# EAGLE design Main (EAGLE 6.5.0)
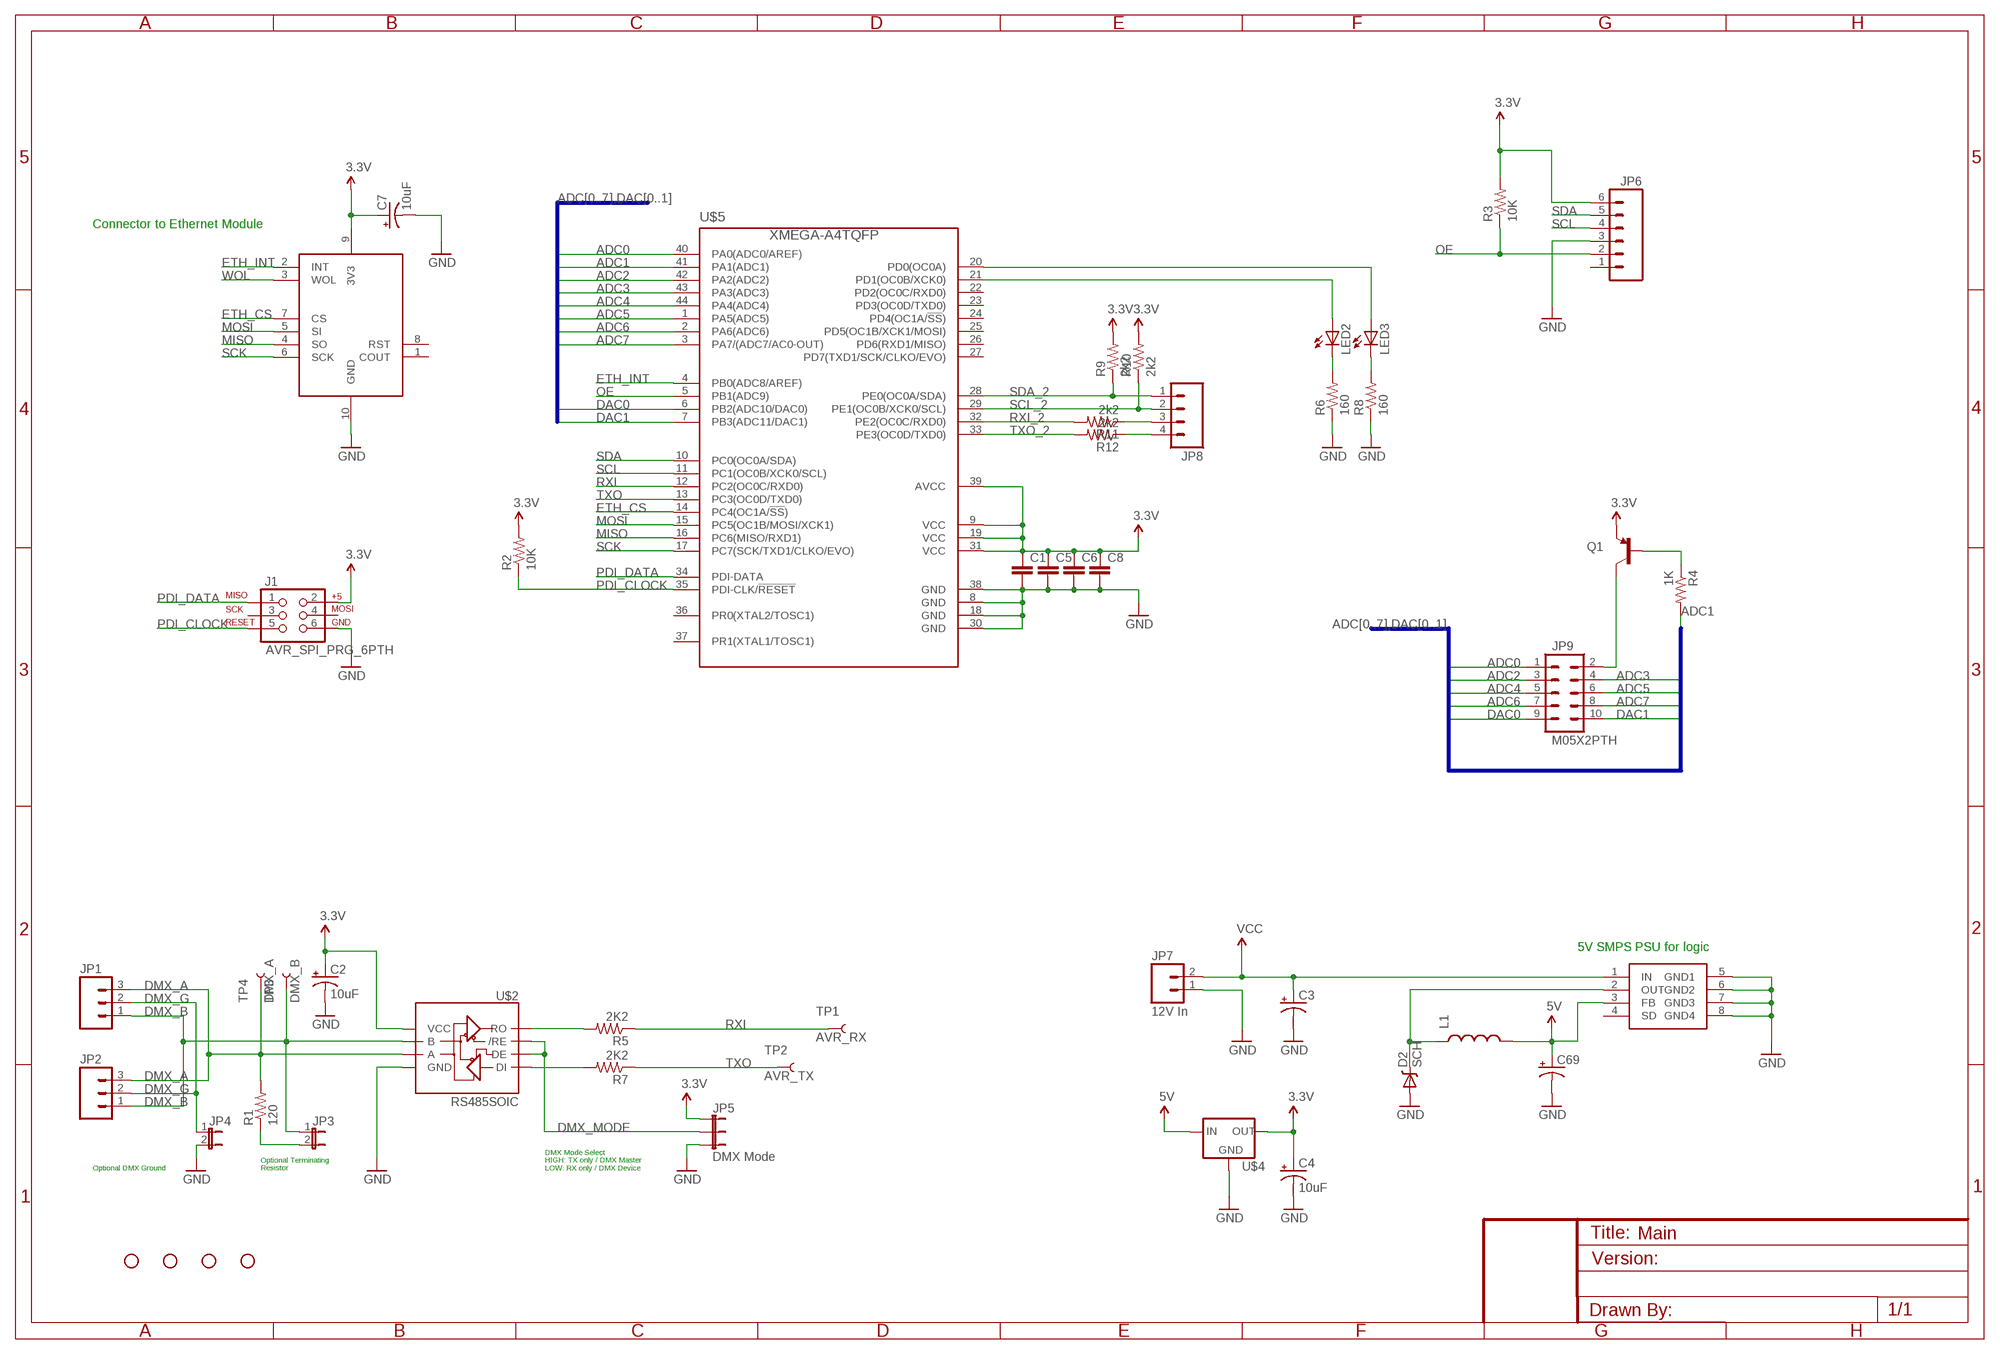
[diagram p0: schematic, sheet 1]

## Parts
C1  CAP0603-CAP  [0603-CAP]
C2  10uF  CAP_POL1206  [EIA3216]
C3  CAP_POLPTH1  [CPOL-RADIAL-100UF-25V]
C4  10uF  CAP_POL1206  [EIA3216]
C5  CAP0603-CAP  [0603-CAP]
C6  CAP0603-CAP  [0603-CAP]
C7  10uF  CAP_POL1206  [EIA3216]
C8  CAP0603-CAP  [0603-CAP]
C69  CAP_POLPTH1  [CPOL-RADIAL-100UF-25V]
D2  SCH  DIODE-SCHOTTKY_  [SMA-DIODE]
J1  AVR_SPI_PRG_6PTH  [2X3]
JP1  M03POLAR  [MOLEX-1X3]
JP2  M03POLAR  [MOLEX-1X3]
JP3  JUMPER-2PTH  [1X02]
JP4  JUMPER-2PTH  [1X02]
JP5  DMX Mode  JUMPER-3PTH  [1X03]
JP6  M06POLAR  [MOLEX-1X6]
JP7  12V In  M023.5MM  [SCREWTERMINAL-3.5MM-2]
JP8  M04PTH  [1X04]
JP9  M05X2PTH  [AVR_ICSP]
L1  INDUCTOR1206H*  [INDUCTOR-1206]
LED2  LED5MM  [LED5MM]
LED3  LED5MM  [LED5MM]
Q1  TRANSISTOR_PNPSMD  [SOT23-3]
R1  120  RESISTOR1206  [1206]
R2  10K  RESISTOR1206  [1206]
R3  10K  RESISTOR1206  [1206]
R4  1K  RESISTOR1206  [1206]
R5  2K2  RESISTOR1206  [1206]
R6  160  RESISTOR1206  [1206]
R7  2K2  RESISTOR1206  [1206]
R8  160  RESISTOR1206  [1206]
R9  2k2  RESISTOR1206  [1206]
R10  2k2  RESISTOR1206  [1206]
R11  2k2  RESISTOR1206  [1206]
R12  2k2  RESISTOR1206  [1206]
STANDOFF1  STAND-OFF  [STAND-OFF]
STANDOFF2  STAND-OFF  [STAND-OFF]
STANDOFF3  STAND-OFF  [STAND-OFF]
STANDOFF4  STAND-OFF  [STAND-OFF]
TP1  AVR_RX  TEST-POINT3X5  [PAD.03X.05]
TP2  AVR_TX  TEST-POINT3X5  [PAD.03X.05]
TP3  DMX_B  TEST-POINT3X5  [PAD.03X.05]
TP4  DMX_A  TEST-POINT3X5  [PAD.03X.05]
U$1  ETHMODULE  [2X5]
U$2  RS485SOIC  [SO08]
U$3  AP1509-33  [SOIC-8]
U$4  V_REG_MIC2920  [SOT223]
U$5  XMEGA-A4TQFP  [TQFP44]

## Nets
3.3V: C1.1 C2.A(+) C4.A(+) C5.1 C6.1 C7.A(+) C8.1 J1.2 JP5.1 JP6.6 Q1.2(E) R2.2 R3.2 R9.2 R10.2 U$1.9(3V3) U$2.8(VCC) U$4.3(OUT) U$5.9(VCC) U$5.19(VCC) U$5.31(VCC) U$5.39(AVCC)
5V: C69.1(+) L1.P$2 U$3.3(FB) U$4.1(IN)
ADC0: JP9.1 U$5.40(PA0(ADC0/AREF))
ADC1: R4.2 U$5.41(PA1(ADC1))
ADC2: JP9.3 U$5.42(PA2(ADC2))
ADC3: JP9.4 U$5.43(PA3(ADC3))
ADC4: JP9.5 U$5.44(PA4(ADC4))
ADC5: JP9.6 U$5.1(PA5(ADC5))
ADC6: JP9.7 U$5.2(PA6(ADC6))
ADC7: JP9.8 U$5.3(PA7/(ADC7/AC0-OUT))
DAC0: JP9.9 U$5.6(PB2(ADC10/DAC0))
DAC1: JP9.10 U$5.7(PB3(ADC11/DAC1))
DMX_A: JP1.3 JP2.3 R1.2 TP4.P$1 U$2.6(A)
DMX_B: JP1.1 JP2.1 JP3.1 TP3.P$1 U$2.7(B)
DMX_G: JP1.2 JP2.2 JP4.1
DMX_MODE: JP5.2 U$2.2(/RE) U$2.3(DE)
ETH_CS: U$1.7(CS) U$5.14(PC4(OC1A/!SS!))
ETH_INT: U$1.2(INT) U$5.4(PB0(ADC8/AREF))
GND: C1.2 C2.C(-) C3.2(-) C4.C(-) C5.2 C6.2 C7.C(-) C8.2 C69.2(-) D2.A J1.6 JP4.2 JP5.3 JP6.3 JP7.1 R6.1 R8.1 U$1.10(GND) U$2.5(GND) U$3.5(GND1) U$3.6(GND2) U$3.7(GND3) U$3.8(GND4) U$4.2(GND) U$5.8(GND) U$5.18(GND) U$5.30(GND) U$5.38(GND)
MISO: U$1.4(SO) U$5.16(PC6(MISO/RXD1))
MOSI: U$1.5(SI) U$5.15(PC5(OC1B/MOSI/XCK1))
N$1: D2.C L1.P$1 U$3.2(OUT)
N$2: JP8.3 R11.1
N$3: R7.2 U$2.4(DI)
N$4: R5.2 U$2.1(RO)
N$5: LED3.A U$5.20(PD0(OC0A))
N$6: LED2.A U$5.21(PD1(OC0B/XCK0))
N$7: JP9.2 Q1.3(C)
N$8: JP3.2 R1.1
N$9: Q1.1(B) R4.1
N$10: LED2.K(C) R6.2
N$11: LED3.K(C) R8.2
N$12: JP8.4 R12.1
OE: JP6.2 R3.1 U$5.5(PB1(ADC9))
PDI_CLOCK: J1.5 R2.1 U$5.35(PDI-CLK/!RESET)
PDI_DATA: J1.1 U$5.34(PDI-DATA)
RXI: R5.1 TP1.P$1 U$5.12(PC2(OC0C/RXD0))
RXI_2: R11.2 U$5.32(PE2(OC0C/RXD0))
SCK: U$1.6(SCK) U$5.17(PC7(SCK/TXD1/CLKO/EVO))
SCL: JP6.4 U$5.11(PC1(OC0B/XCK0/SCL))
SCL_2: JP8.2 R10.1 U$5.29(PE1(OC0B/XCK0/SCL))
SDA: JP6.5 U$5.10(PC0(OC0A/SDA))
SDA_2: JP8.1 R9.1 U$5.28(PE0(OC0A/SDA))
TXO: R7.1 TP2.P$1 U$5.13(PC3(OC0D/TXD0))
TXO_2: R12.2 U$5.33(PE3(OC0D/TXD0))
VCC: C3.1(+) JP7.2 U$3.1(IN)
WOL: U$1.3(WOL)
Unconnected: J1.3 J1.4 JP6.1 U$3.4(SD) U$5.22(PD2(OC0C/RXD0)) U$5.23(PD3(OC0D/TXD0)) U$5.24(PD4(OC1A/!SS!)) U$5.25(PD5(OC1B/XCK1/MOSI)) U$5.26(PD6(RXD1/MISO)) U$5.27(PD7(TXD1/SCK/CLKO/EVO)) U$5.36(PR0(XTAL2/TOSC1)) U$5.37(PR1(XTAL1/TOSC1))

## Buses
ADC[0..7],DAC[0..1]

## Notes on the sheet
- Connector to Ethernet Module
- 5V SMPS PSU for logic
- Optional DMX Ground
- Optional Terminating
  Resistor
- DMX Mode Select
  HIGH: TX only / DMX Master
  LOW: RX only / DMX Device

## Power pins joined to a net without a drawn wire
COUT: U$1.1(COUT)
RST: U$1.8(RST)

## Library data of the parts
C1 C5 C6 C8 = 1_SparkFun-Capacitors:CAP: Capacitor Standard 0603 ceramic capacitor, and 0.1" leaded capacitor.
C2-C4 C7 C69 = 1_SparkFun-Capacitors:CAP_POL: Capacitor Polarized These are standard SMD and PTH capacitors. Normally 10uF, 47uF, and 100uF in electrolytic and tantalum varieties. Always verify the external diameter of the through hole cap, it varies with capacity, voltage, and manufacturer. The EIA devices should be standard.
D2 = 1_SparkFun-DiscreteSemi:DIODE-SCHOTTKY: Commonly MBRA140.
J1 = 1_SparkFun-Connectors:AVR_SPI_PRG_6: AVR ISP 6 Pin This is the reduced ISP connector for AVR programming. Common on Arduino. This footprint will take up less PCB space and can be used with a 10-pin to 6-pin adapter such as SKU: BOB-08508
JP1 JP2 = 1_SparkFun-Connectors:M03: Header 3 Standard 3-pin 0.1" header. Use with straight break away headers (SKU : PRT-00116), right angle break away headers (PRT-00553), swiss pins (PRT-00743), machine pins (PRT-00117), and female headers (PRT-00115). Molex polarized connector foot print use with SKU : PRT-08232 with associated crimp pins and housings.
JP3 JP4 = 1_SparkFun-Passives:JUMPER-2: Jumper Basic 0.1" spaced jumper. Use with breakaway headers.
JP5 = 1_SparkFun-Passives:JUMPER-3
JP6 = 1_SparkFun-Connectors:M06: Header 6 Standard 6-pin 0.1" header. Use with straight break away headers (SKU : PRT-00116), right angle break away headers (PRT-00553), swiss pins (PRT-00743), machine pins (PRT-00117), and female headers (PRT-00115). Molex polarized connector foot print use with SKU : PRT-08094 with associated crimp pins and housings. NOTES ON THE VARIANTS LOCK and LOCK_LONGPADS... This footprint was designed to help hold the alignment of a through-hole component (i.e. 6-pin header) while soldering it into place. You may notice that each hole has been shifted either up or down by 0.005 of an inch from it's more standard position (which is a perfectly straight line). This slight alteration caused the pins (the squares in the middle) to touch the edges of the holes. Because they are alternating, it causes a "brace" to hold the component in place. 0.005 has proven to be the perfect amount of "off-center" position when using our standard breakaway headers. Although looks a little odd when you look at the bare footprint, once you have a header in there, the alteration is very hard to notice. Also,if you push a header all the way into place, it is covered up entirely on the bottom side. This idea of altering the position of holes to aid alignment will be further integrated into the Sparkfun Library for other footprints. It can help hold any component with 3 or more connection pins.
JP7 = 1_SparkFun-Connectors:M02: Standard 2-pin 0.1" header. Use with - straight break away headers ( PRT-00116) - right angle break away headers (PRT-00553) - swiss pins (PRT-00743) - machine pins (PRT-00117) - female headers (PRT-00115) Molex polarized connector foot print use with: PRT-08233 with associated crimp pins and housings. 2.54_SCREWTERM for use with PRT-10571. 3.5mm Screw Terminal footprints for PRT-08084 5mm Screw Terminal footprints for use with PRT-08433
JP8 = 1_SparkFun-Connectors:M04: Header 4 Standard 4-pin 0.1" header. Use with straight break away headers (SKU : PRT-00116), right angle break away headers (PRT-00553), swiss pins (PRT-00743), machine pins (PRT-00117), and female headers (PRT-00115). Molex polarized connector foot print use with SKU : PRT-08231 with associated crimp pins and housings. 1MM SMD Version SKU: PRT-10208
JP9 = 1_SparkFun-Connectors:M05X2: Header 5x2 Standard 10-pin dual row 0.1" header. Commonly used with AVR-ISP. Use with Spark Fun Electronics SKU: PRT-00778
L1 = 1_SparkFun-Passives:INDUCTOR: Inductors Basic Inductor/Choke - 0603 and 1206. Footprints are not proven and vary greatly between part numbers. SRN6045- 33uH, 20% 1.4A SDR0403-560KL - 56uH, 10%, 500mA RMS/740mA peak
LED2 LED3 = 1_SparkFun-LED:LED: LEDs Standard schematic elements and footprints for 5mm, 3mm, 1206, and 0603 sized LEDs. 5mm - Spark Fun Electronics SKU : COM-00529 (and others)
Q1 = 1_SparkFun-DiscreteSemi:TRANSISTOR_PNP: Generic PNP BJT Double check pinouts against datasheets- not all devices are the same! MMBT3906 - 40V 200mA SOT-23 (TRANS-08052) MMBT4403 - 40V 600mA SOT-23 (TRANS-09245)
R1-R12 = 1_SparkFun-Resistors:RESISTOR: Resistor Basic schematic elements and footprints for 0603, 1206, and PTH resistors.
STANDOFF1-STANDOFF4 = 1_SparkFun-Electromechanical:STAND-OFF: #4 Stand Off This is the mechanical footprint for a #4 phillips button head screw. Use the keepout ring to avoid running the screw head into surrounding components. SKU : PRT-00447
TP1-TP4 = 1_SparkFun-Passives:TEST-POINT: Bare copper test points for troubleshooting or ICT
U$1 = 0_Tristan's_Lib:ETHMODULE
U$2 = 1_SparkFun-DigitalIC:RS485: RS485 transceiver
U$3 = 0_Tristan's_Lib:AP1509-33
U$4 = 1_SparkFun-PowerIC:V_REG_MIC2920: MIC2920A (http://www.micrel.com/_PDF/mic2920.pdf) - 400mA output LDO Regulator
U$5 = avr-7:XMEGA-A4: Atmel XMega A4 series processor

## Board
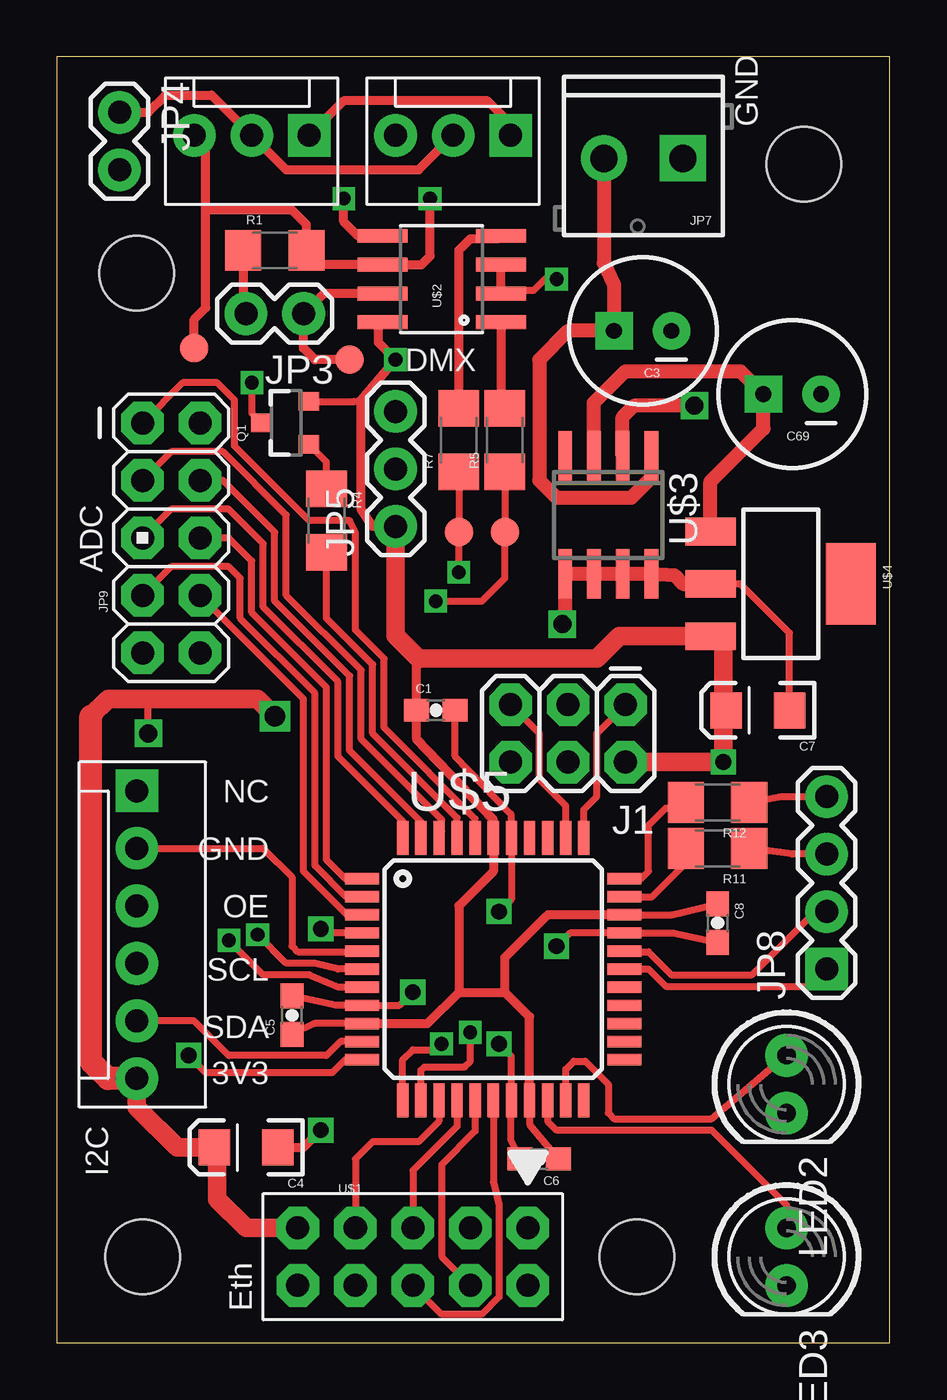
[diagram p1: board, top side]
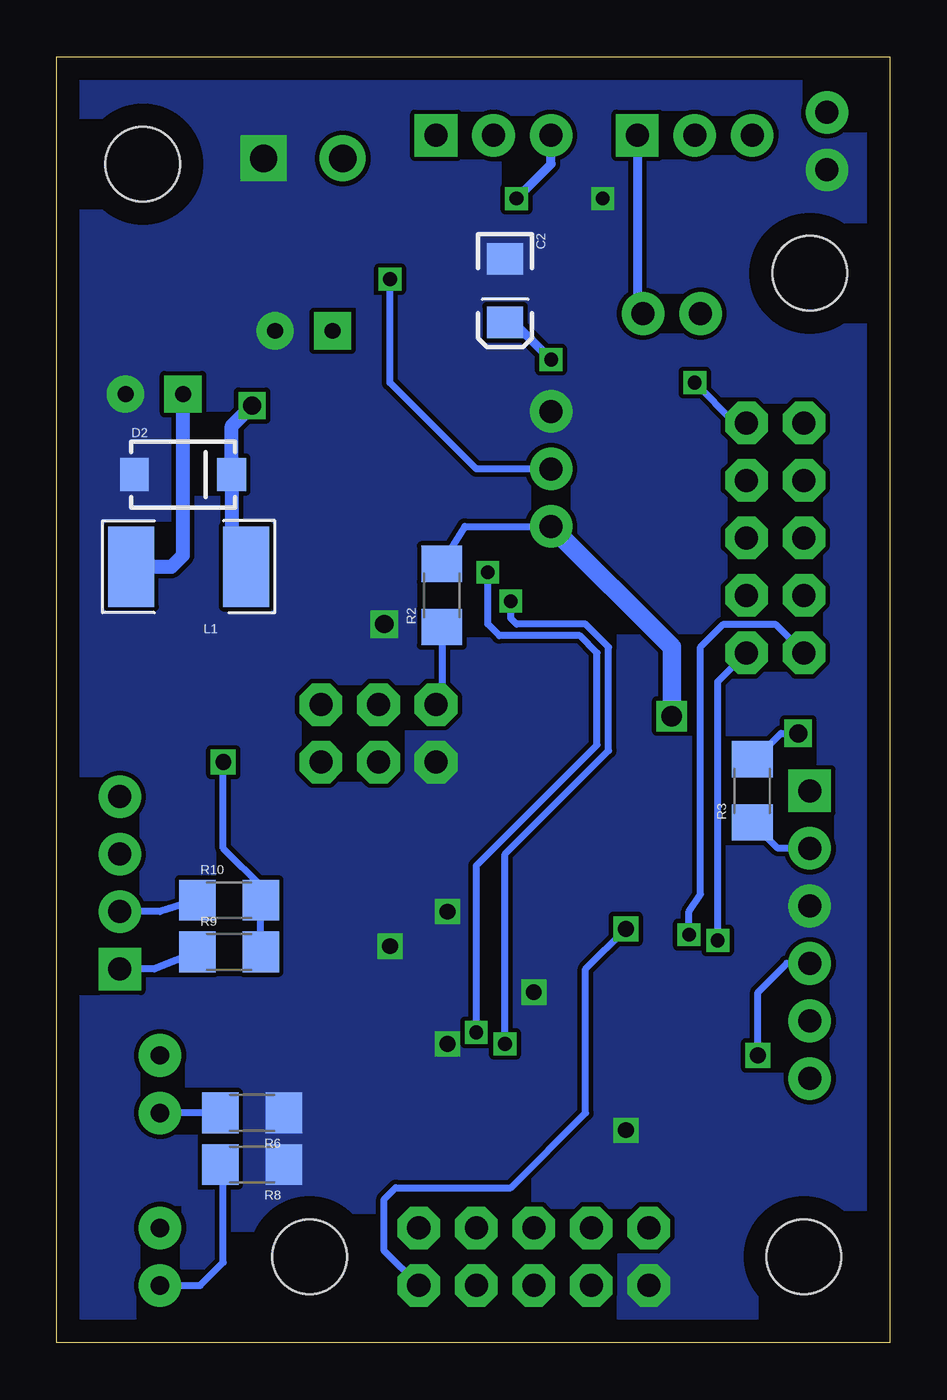
[diagram p2: board, bottom side, seen from below]

Size 36.82 x 56.82 mm. Coordinates in mm from the lower left corner, seen from the top.
Outline: 36.82,0 36.82,56.82 0,56.82 0,0 36.82,0
Copper layers (1*16): Top 0.035mm / dielectric 1.5mm / Bottom 0.035mm
Design rules "default": minimum track width 10mil, minimum drill 24mil, track to track 8mil, track to pad 8mil, pad to pad 8mil, via to via 8mil, smd to smd 8mil, copper to edge 40mil, drill to drill 8mil, minimum pad ring 10mil, minimum via ring 8mil, stop-mask expansion 4mil, vias tented up to drill 0mil, thermal gap 10mil

### Footprints (pad centres in the part's own frame; a part is rotated, then mirrored left to right if it is on the bottom)
0603-CAP = smd 1.1 x 1: 1 -0.85,0; 2 0.85,0
EIA3216 = smd 1.4 x 1.6: A 1.4,0; C -1.4,0
CPOL-RADIAL-100UF-25V = drill 0.7 pad 1.651 square: 1 1.27,0 | drill 0.7 pad 1.651: 2 -1.27,0
SMA-DIODE = smd 1.27 x 1.47: A -2.15,0; C 2.15,0
2X3 = drill 1.016 pad 1.88 octagon: 1 0,0; 2 0,2.54; 3 2.54,0; 4 2.54,2.54; 5 5.08,0; 6 5.08,2.54
MOLEX-1X3 = drill 1.016 pad 1.88 square: 1 0,0 | drill 1.016 pad 1.88: 2 2.54,0; 3 5.08,0
1X02 = drill 1.016 pad 1.88: 1 0,0; 2 2.54,0
1X03 = drill 1.016 pad 1.88: 1 0,0; 2 2.54,0; 3 5.08,0
MOLEX-1X6 = drill 1.016 pad 1.88 square: 1 0,0 | drill 1.016 pad 1.88: 2 2.54,0; 3 5.08,0; 4 7.62,0; 5 10.16,0; 6 12.7,0
SCREWTERMINAL-3.5MM-2 = drill 1.2 pad 2.032 square: 1 0,0 | drill 1.2 pad 2.032: 2 3.5,0
1X04 = drill 1.016 pad 1.88 square: 1 0,0 | drill 1.016 pad 1.88: 2 2.54,0; 3 5.08,0; 4 7.62,0
AVR_ICSP = drill 1.016 pad 1.88 octagon: 1 -1.27,5.08; 2 1.27,5.08; 3 -1.27,2.54; 4 1.27,2.54; 5 -1.27,0; 6 1.27,0; 7 -1.27,-2.54; 8 1.27,-2.54; 9 -1.27,-5.08; 10 1.27,-5.08
INDUCTOR-1206 = smd 2.032 x 3.556: P$1 -2.54,0; P$2 2.54,0
LED5MM = drill 0.813 pad 1.88: A -1.27,0; K 1.27,0
SOT23-3 = smd 0.8 x 0.9: 1 -0.95,-1; 2 0.95,-1; 3 0,1.1
1206 = smd 1.6 x 1.8: 1 -1.4,0; 2 1.4,0
STAND-OFF = hole 3.302: 0,0
PAD.03X.05 = smd 1.27 x 1.27: P$1 0,0
2X5 = drill 1.016 pad 1.88 octagon: 1 -1.27,5.08; 2 1.27,5.08; 3 -1.27,2.54; 4 1.27,2.54; 5 -1.27,0; 6 1.27,0; 7 -1.27,-2.54; 8 1.27,-2.54; 9 -1.27,-5.08; 10 1.27,-5.08
SO08 = smd 0.61 x 2.21: 1 -1.905,-2.616; 2 -0.635,-2.616; 3 0.635,-2.616; 4 1.905,-2.616; 5 1.905,2.616; 6 0.635,2.616; 7 -0.635,2.616; 8 -1.905,2.616
SOIC-8 = smd 0.6 x 2.2: 1 -1.905,-2.6; 2 -0.635,-2.6; 3 0.635,-2.6; 4 1.905,-2.6; 5 1.905,2.6; 6 0.635,2.6; 7 -0.635,2.6; 8 -1.905,2.6
SOT223 = smd 1.219 x 2.235: 1 -2.311,-3.099; 2 0,-3.099; 3 2.311,-3.099 | smd 3.6 x 2.2: 4 0,3.099
TQFP44 = smd 1.5 x 0.5: 1 -5.8,4; 2 -5.8,3.2; 3 -5.8,2.4; 4 -5.8,1.6; 5 -5.8,0.8; 6 -5.8,0; 7 -5.8,-0.8; 8 -5.8,-1.6; 9 -5.8,-2.4; 10 -5.8,-3.2; 11 -5.8,-4; 23 5.8,-4; 24 5.8,-3.2; 25 5.8,-2.4; 26 5.8,-1.6; 27 5.8,-0.8; 28 5.8,0; 29 5.8,0.8; 30 5.8,1.6; 31 5.8,2.4; 32 5.8,3.2; 33 5.8,4 | smd 0.5 x 1.5: 12 -4,-5.8; 13 -3.2,-5.8; 14 -2.4,-5.8; 15 -1.6,-5.8; 16 -0.8,-5.8; 17 0,-5.8; 18 0.8,-5.8; 19 1.6,-5.8; 20 2.4,-5.8; 21 3.2,-5.8; 22 4,-5.8; 34 4,5.8; 35 3.2,5.8; 36 2.4,5.8; 37 1.6,5.8; 38 0.8,5.8; 39 0,5.8; 40 -0.8,5.8; 41 -1.6,5.8; 42 -2.4,5.8; 43 -3.2,5.8; 44 -4,5.8

### Placement (x,y rotation side)
C1  16.75,27.94 0 top
C2  17.01,46.48 270 bottom
C3  25.9,44.7 180 top
C4  8.37,8.64 180 top
C5  10.4,14.48 90 top
C6  21.33,8.13 180 top
C7  30.98,27.94 180 top
C8  29.2,18.54 270 top
C69  32.5,41.91 180 top
D2  31.23,38.35 0 bottom
J1  25.14,28.19 180 top
JP1  11.17,53.34 180 top
JP2  20.06,53.34 180 top
JP3  10.91,45.47 180 top
JP4  2.78,54.36 270 top
JP5  14.98,36.07 90 top
JP6  3.55,24.38 270 top
JP7  27.68,52.32 180 top
JP8  34.03,16.51 90 top
JP9  5.07,35.56 0 top
L1  30.98,34.29 180 bottom
LED2  32.25,11.43 270 top
LED3  32.25,3.81 270 top
Q1  10.15,40.64 90 top
R1  9.64,48.26 0 top
R2  19.8,33.02 90 bottom
R3  6.09,24.38 90 bottom
R4  11.93,36.32 270 top
R5  19.8,39.88 90 top
R6  28.18,10.16 180 bottom
R7  17.77,39.88 90 top
R8  28.18,7.87 180 bottom
R9  29.2,17.27 0 bottom
R10  29.2,19.56 0 bottom
R11  29.2,21.84 180 top
R12  29.2,23.88 180 top
STANDOFF1  25.64,3.81 90 top
STANDOFF2  3.8,3.81 90 top
STANDOFF3  3.55,47.24 90 top
STANDOFF4  33.01,52.07 90 top
TP1  19.8,35.81 90 top
TP2  17.77,35.81 90 top
TP3  12.94,43.43 90 top
TP4  6.09,43.94 90 top
U$1  15.74,3.81 270 top
U$2  17.01,46.99 90 top
U$3  24.37,36.58 180 top
U$4  31.99,33.53 270 top
U$5  19.29,16.51 0 top

### Tracks (layer width: path | path; a pad name or v marks a point on that pad's centre or on a via)
3.3V  (via drill 0.6, 0.7, 0.8, 0.9)
  Top 0.305: U$5.9 11.39,14.11 C5.1 | U$5.19 20.89,9.66 C6.1 | U$5.31 27.19,18.91 C8.1 | Q1.2 13.13,41.59 13.45,41.66 | v4.05,26.92 4.05,28.45
  Top 0.406: U$5.19 20.89,14.4 19.8,15.49 | 19.8,15.49 19.8,17.02 21.58,18.8 21.72,18.91 U$5.31 | U$5.9 16.39,14.11 17.77,15.49 | 17.77,15.49 19.8,15.49 | 17.77,15.49 17.77,19.3 19.29,20.83 U$5.39 19.29,23.11 15.9,26.67 C1.1 15.9,30.09 16.02,30.2 | U$2.8 14.21,44.91 14.21,44.2 v14.98,43.43 13.45,41.66 13.45,36.83 13.96,36.07 JP5.1 | 29.58,27.56 C7.A 29.45,27.43
  Top 0.813: J1.2 v29.45,25.65 29.45,27.43 29.45,30.96 U$4.3 24.86,31.22 23.87,30.23 16.04,30.23 16.02,30.2 14.98,31.24 JP5.1 | JP6.6 3.55,10.41 5.32,8.64 C4.A 7.1,8.51 7.1,6.35 8.37,5.08 U$1.9 | 1.51,27.69 2.28,28.45 4.05,28.45 8.88,28.45 v9.64,27.69
  Top 1.016: JP6.6 2.28,11.68 1.51,12.45 1.51,27.69
  Bottom 0.305: R3.2 5.96,25.78 4.82,26.92 v4.05,26.92 | R9.2 27.8,19.27 27.68,19.39 27.68,19.43 | 27.68,19.43 R10.2 | 27.68,19.43 27.68,20.07 29.45,21.84 v29.45,25.65 | R2.2 18.79,36.07 JP5.1
  Bottom 0.406: C2.A 16.62,45.08 v14.98,43.43
  Bottom 0.813: v9.64,27.69 9.64,30.73 JP5.1
5V
  Top 0.61: U$3.3 23.74,41.53 25.14,42.93 30.22,42.93 C69.1 31.23,40.39 28.89,38.05 U$4.1
  Bottom 0.61: L1.P$2 31.74,34.29 31.23,34.8 C69.1
ADC0
  Top 0.305: U$5.40 18.49,23.15 14.47,27.18 14.47,30.23 13.2,31.5 13.2,35.81 12.94,36.32 11.17,36.32 7.86,39.62 7.86,41.66 7.1,42.42 5.58,42.42 JP9.1
ADC1
  Top 0.305: U$5.41 17.69,23.19 13.96,26.92 13.96,29.97 11.93,32 R4.2
ADC2
  Top 0.305: U$5.42 16.89,22.49 17.01,22.61 17.01,23.11 13.45,26.67 13.45,29.72 10.15,33.02 10.15,36.58 7.36,39.37 5.07,39.37 JP9.3
ADC3
  Top 0.305: U$5.43 16.09,23.01 12.94,26.16 12.94,29.46 9.64,32.77 9.64,35.81 7.36,38.1 JP9.4
ADC4
  Top 0.305: U$5.44 15.29,23.05 12.44,25.91 12.44,29.21 9.13,32.51 9.13,35.31 7.61,36.83 5.07,36.83 JP9.5
ADC5
  Top 0.305: U$5.1 12.75,20.51 11.93,21.34 11.93,28.96 8.63,32.26 8.63,34.54 7.61,35.56 JP9.6
ADC6
  Top 0.305: U$5.2 12.79,19.71 11.42,21.08 11.42,28.7 8.12,32 8.12,33.78 7.61,34.29 5.07,34.29 JP9.7
ADC7
  Top 0.305: U$5.3 12.83,18.91 10.91,20.83 10.91,28.45 JP9.8
DAC0  (via drill 0.6)
  Top 0.305: U$5.6 12.44,16.51 11.42,16.76 10.15,16.76 v8.88,18.03
  Bottom 0.305: v8.88,18.03 8.88,19.05 8.37,19.81 8.37,30.73 7.36,31.75 5.07,31.75 JP9.9
DAC1  (via drill 0.6)
  Top 0.305: U$5.7 12.47,15.71 11.17,16.26 9.13,16.26 v7.61,17.78
  Bottom 0.305: v7.61,17.78 7.61,29.21 JP9.10
DMX_A  (via drill 0.6)
  Top 0.406: v16.5,50.55 16.5,48.01 16.12,47.62 U$2.6 11.68,47.62 R1.2 11.04,49.4 10.4,50.04 6.59,50.04 | TP4.P$1 6.09,45.21 6.59,45.72 6.59,50.04 | 6.59,50.04 6.59,52.83 JP1.3
  Bottom 0.406: v16.5,50.55 14.98,52.07 JP2.3
DMX_B
  Top 0.406: JP2.1 20.06,53.85 19.04,54.86 12.69,54.86 JP1.1 | U$2.7 11.8,46.35 JP3.1 10.91,43.94 11.42,43.43 TP3.P$1
  Bottom 0.406: JP1.1 11.17,45.72 JP3.1
DMX_G
  Top 0.406: JP4.1 4.05,54.36 4.82,55.12 6.85,55.12 JP1.2 10.15,51.82 15.99,51.82 JP2.2
DMX_MODE  (via drill 0.6)
  Top 0.305: v22.09,46.99 21.58,46.99 21.07,46.48 19.75,46.48 U$2.2
  Top 0.406: U$2.2 U$2.3
  Bottom 0.305: JP5.2 18.28,38.61 22.09,42.42 v22.09,46.99
ETH_CS
  Top 0.305: U$5.14 16.89,9.79 15.99,8.89 13.96,8.89 13.2,8.13 U$1.7
ETH_INT  (via drill 0.7)
  Top 0.305: U$5.4 11.85,18.11 v11.67,18.29
  Bottom 0.305: U$1.2 22.34,4.06 22.34,6.35 21.83,6.86 16.75,6.86 13.45,10.16 13.45,16.51 v11.67,18.29
GND  (via drill 0.6, 0.7, 0.8)
  Top 0.305: C1.2 17.6,25.91 20.06,23.37 20.09,23.33 U$5.38 20.09,19.6 v19.55,19.05 | v22.09,17.53 22.67,18.11 U$5.30 27.26,18.11 C8.2 | v19.55,13.21 20.09,12.66 U$5.18 20.09,10.2 20.06,10.16 20.06,8.98 C6.2 | v15.74,15.49 15.15,14.91 U$5.8 12.35,14.91 C5.2 | C7.C 32.38,31.37 30.22,33.53 U$4.2
  Top 0.406: C4.C 10.91,8.64 v11.67,9.4 | U$2.5 13.33,48.9 12.69,49.53 v12.69,50.55
  Top 0.61: v22.34,31.75 22.47,32.38 U$3.5 U$3.6 U$3.7 U$3.8 27.29,33.91 27.68,33.53 U$4.2
  pour Bottom (no thermals): 1.01,0.76 1.01,55.88 36.06,55.88 36.06,0.76
MISO
  Top 0.305: U$5.16 18.49,9.36 17.01,7.87 17.01,3.81 U$1.4
MOSI
  Top 0.305: U$5.15 17.69,9.58 15.74,7.62 U$1.5
N$1  (via drill 0.8)
  Top 0.61: U$3.2 25.01,40.89 25.52,41.4 v28.18,41.4
  Bottom 0.61: v28.18,41.4 29.08,40.5 D2.C 29.08,34.93 L1.P$1
N$2
  Top 0.305: JP8.3 32.5,21.59 R11.1
N$3
  Top 0.406: R7.2 17.77,48.26 18.28,48.77 19.5,48.77 U$2.4
N$4
  Top 0.406: U$2.1 19.62,41.46 R5.2
N$5
  Top 0.305: U$5.20 21.69,9.79 22.09,9.4 28.95,9.4 32.25,6.1 LED3.A
N$6
  Top 0.305: LED2.A 28.95,9.91 24.63,9.91 24.37,10.16 24.37,11.43 23.36,12.45 22.85,12.45 22.49,12.09 U$5.21
N$7  (via drill 0.6)
  Top 0.305: v8.63,42.42 8.63,41.06 Q1.3
  Bottom 0.305: JP9.2 6.85,40.64 v8.63,42.42
N$8
  Top 0.406: R1.1 8.24,45.6 JP3.2
N$9
  Top 0.305: R4.1 11.93,38.91 Q1.1
N$10
  Bottom 0.305: R6.2 LED2.K
N$11
  Bottom 0.305: LED3.K 30.47,2.54 29.45,3.56 29.45,7.74 R8.2
N$12
  Top 0.305: R12.1 31.99,24.13 JP8.4
OE
  Top 0.305: JP6.2 9.13,21.84 10.4,20.57 10.4,17.53 10.66,17.27 13.46,17.27 U$5.5
  Bottom 0.305: JP6.2 4.95,21.84 R3.1
PDI_CLOCK
  Top 0.305: U$5.35 22.49,23.72 21.33,24.89 21.33,26.92 J1.5
  Bottom 0.305: R2.1 19.8,28.7 J1.5
PDI_DATA
  Top 0.305: U$5.34 23.29,23.56 23.87,24.13 23.87,26.92 J1.1
RXI  (via drill 0.6)
  Top 0.305: R5.1 TP1.P$1 19.8,33.78 18.79,32.77 v16.75,32.77 | U$5.12 15.29,12.51 15.74,12.95 16.75,12.95 v17.01,13.21
  Bottom 0.305: v17.01,13.21 17.01,21.59 12.44,26.16 12.44,30.73 13.45,31.75 16.5,31.75 16.75,32 v16.75,32.77
RXI_2
  Top 0.305: U$5.32 26.3,19.71 27.93,21.34 27.93,21.71 R11.2
SCK
  Top 0.305: U$5.17 19.29,7.11 19.55,6.1 19.55,2.03 18.79,1.27 17.01,1.27 U$1.6
SCL  (via drill 0.7)
  Top 0.305: U$5.11 12.75,12.51 12.18,11.94 6.59,11.94 v5.83,12.7
  Bottom 0.305: v5.83,12.7 5.83,15.49 4.56,16.76 JP6.4
SCL_2
  Top 0.305: U$5.29 25.61,17.31 25.64,17.27 26.15,17.27 27.17,16.26 30.72,16.26 33.52,19.05 JP8.2
  Bottom 0.305: R10.1 32.25,19.05 JP8.2
SDA
  Top 0.305: U$5.10 12.54,13.31 11.93,12.7 7.61,12.7 6.09,14.22 JP6.5
SDA_2
  Top 0.305: U$5.28 26.15,16.51 26.91,15.75 33.26,15.75 JP8.1
  Bottom 0.305: R9.1 32.5,16.51 JP8.1
TXO  (via drill 0.6)
  Top 0.305: R7.1 TP2.P$1 v17.77,34.04 | U$5.13 16.09,12.04 16.25,12.19 18.02,12.19 18.28,12.45 v18.28,13.72
  Bottom 0.305: v18.28,13.72 18.28,21.08 12.94,26.42 12.94,30.48 13.71,31.24 17.26,31.24 17.77,31.75 v17.77,34.04
TXO_2
  Top 0.305: U$5.33 25.83,20.51 26.15,20.83 26.15,22.86 26.91,23.62 27.55,23.62 R12.2
VCC
  Top 0.61: JP7.2 24.18,47.7 24.63,46.74 C3.1 22.6,44.7 21.33,43.43 21.33,38.1 22.09,37.34 25.39,37.34 26.28,38.23 U$3.1

### Text on the board
tPlace: GND | DMX | ADC | NC | GND | OE | SCL | SDA | 3V3 | I2C | Eth